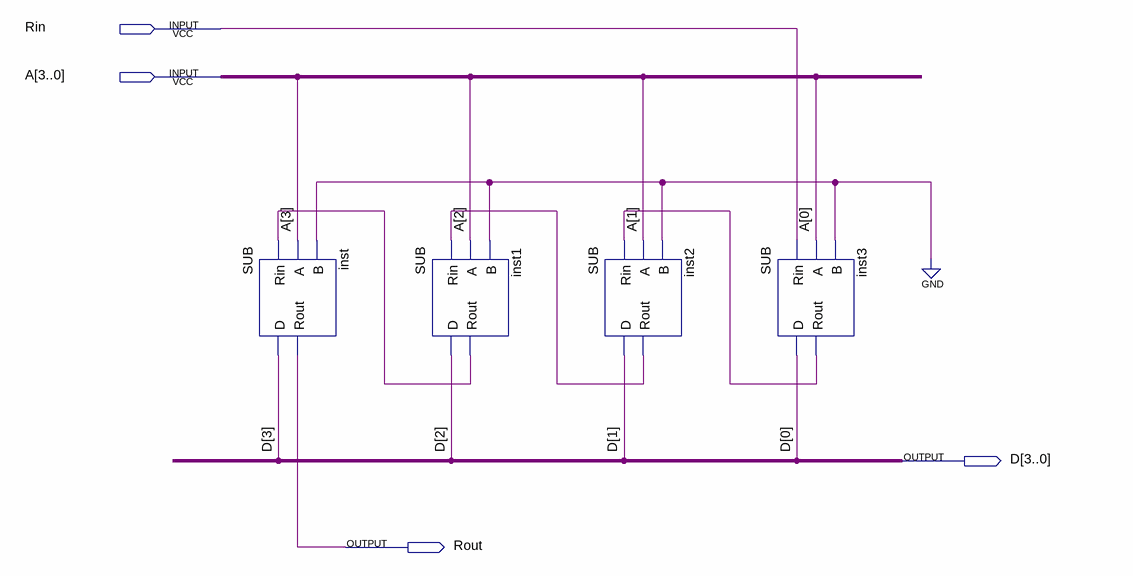
[diagram p0: schematic sheet]
// Quartus schematic DEG1.bdf as structural Verilog: 4 symbols, 4 pins
module DEG1 (
  input  Rin,
  input  [3:0] A,
  output [3:0] D,
  output Rout
);

  wire inst1_rout, inst2_rout, inst3_rout;

  SUB inst (.Rin(inst1_rout), .A(A[3]), .B(1'b0), .D(D[3]), .Rout(Rout));
  SUB inst1 (.Rin(inst2_rout), .A(A[2]), .B(1'b0), .D(D[2]), .Rout(inst1_rout));
  SUB inst2 (.Rin(inst3_rout), .A(A[1]), .B(1'b0), .D(D[1]), .Rout(inst2_rout));
  SUB inst3 (.Rin(Rin), .A(A[0]), .B(1'b0), .D(D[0]), .Rout(inst3_rout));
endmodule
